# Altium schematic sheet Block Diagram.SchDoc
size A3; SheetNumber: 1; SheetTotal: 3; PreparedBy: PreparedBy; ProjectDescription: Project Description; ProjectUnit: mm; ReleaseDate: ReleaseDate; Department: Department
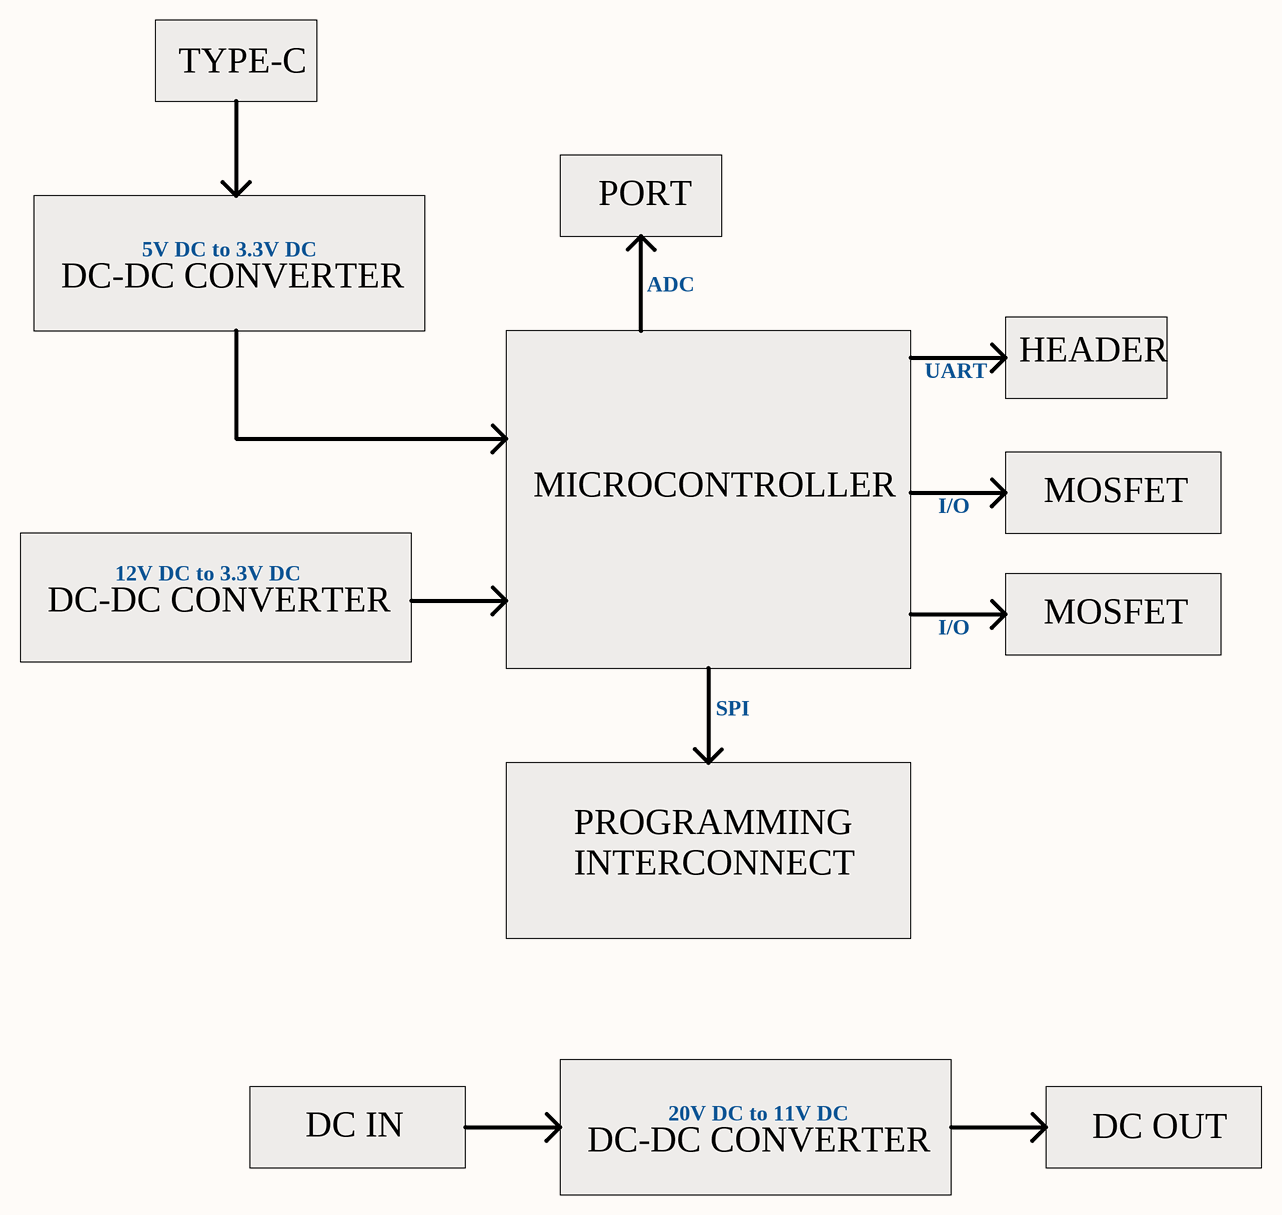
[diagram p0: Block Diagram.SchDoc]

## Notes on the sheet
- TYPE-C
- PORT
- DC-DC CONVERTER
- 5V DC to 3.3V DC
- ADC
- HEADER
- UART
- MICROCONTROLLER
- MOSFET
- I/O
- 12V DC to 3.3V DC
- SPI
- PROGRAMMING
- INTERCONNECT
- DC IN
- 20V DC to 11V DC
- DC OUT
- File Name:
- Prepared:
- Size:
- Description:
- Unit:
- A3
- Released:
- Edited:
- Revision:
- Checked:
- Department:
- Approved:
- Sheet: